# Altium project night-cone-proto0.PrjPcb (part 2 of 2)
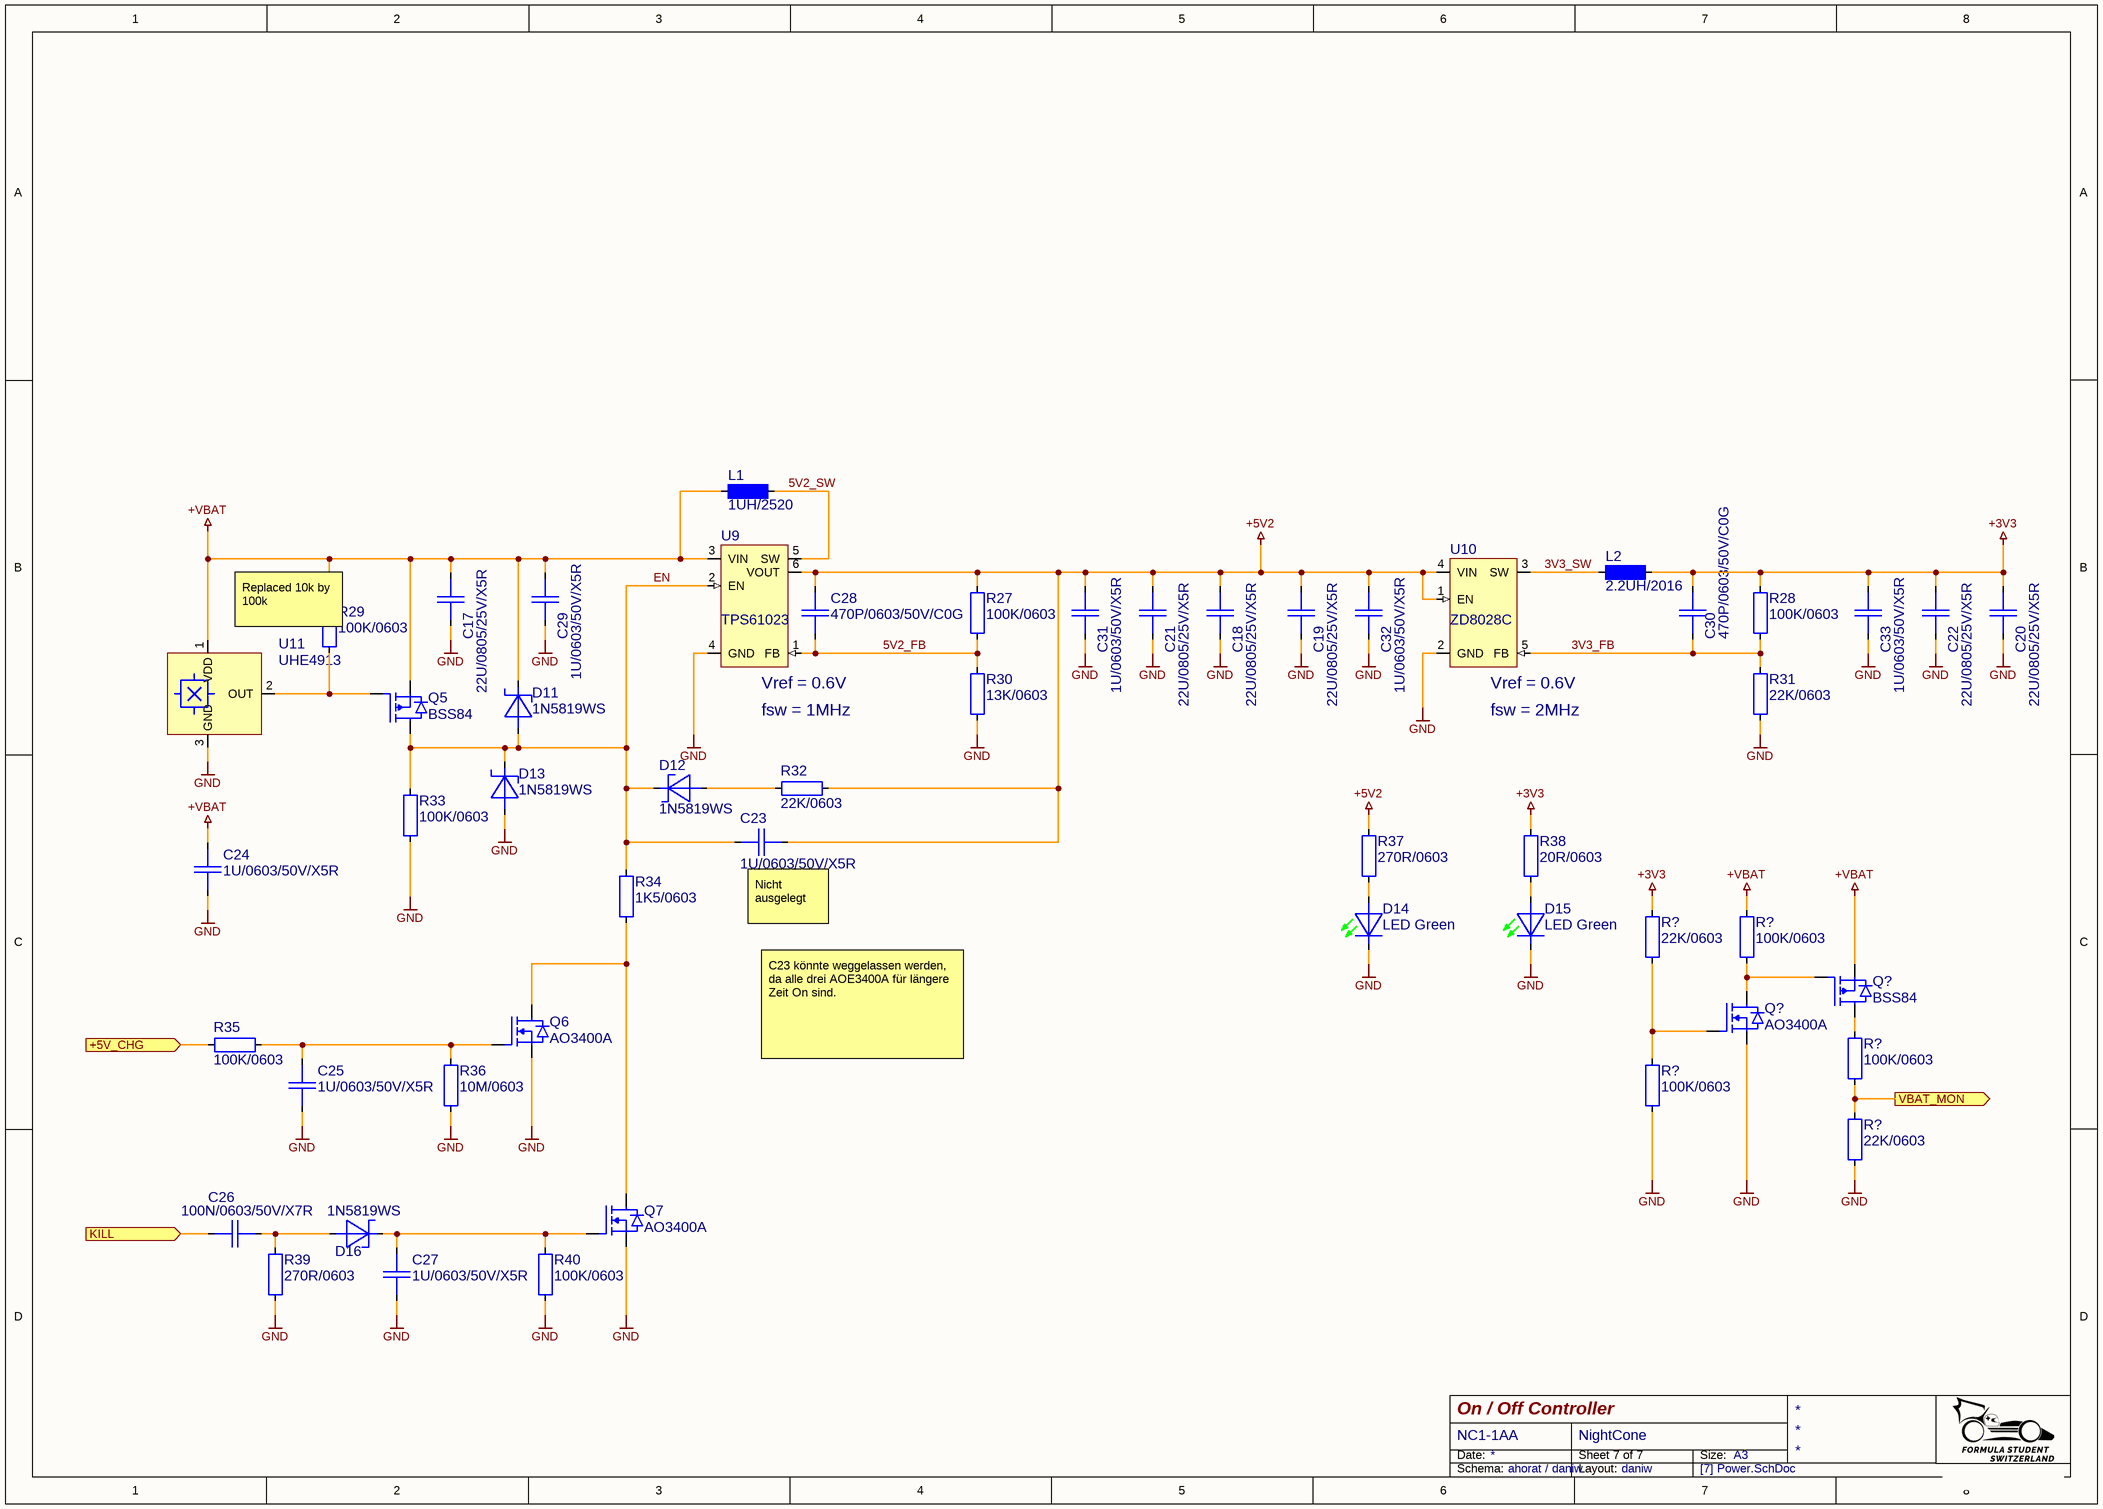
[diagram p7: [7] Power.SchDoc]

## Nets that join several sheets
+3V3: [2] Control (M1.8 M2.8 R1.1 R2.1), [7] Power (8 pins)
+5V2: [3] FailSafe (15 pins), Lights/LED0 (C11_LED0.1 R15_LED0.1 U6_LED0.2), Lights/LED1 (C11_LED1.1 R15_LED1.1 U6_LED1.2), Lights/LED2 (C11_LED2.1 R15_LED2.1 U6_LED2.2), Lights/LED3 (C11_LED3.1 R15_LED3.1 U6_LED3.2), Lights/LED4 (C11_LED4.1 R15_LED4.1 U6_LED4.2), Lights/LED5 (C11_LED5.1 R15_LED5.1 U6_LED5.2), Lights/LED6 (C11_LED6.1 R15_LED6.1 U6_LED6.2), Lights/LED7 (C11_LED7.1 R15_LED7.1 U6_LED7.2), Lights/LED8 (C11_LED8.1 R15_LED8.1 U6_LED8.2), Lights/LED9 (C11_LED9.1 R15_LED9.1 U6_LED9.2), Lights/LED10 (C11_LED10.1 R15_LED10.1 U6_LED10.2), Lights/LED11 (C11_LED11.1 R15_LED11.1 U6_LED11.2), Lights/LED12 (C11_LED12.1 R15_LED12.1 U6_LED12.2), Lights/LED13 (C11_LED13.1 R15_LED13.1 U6_LED13.2), Lights/LED14 (C11_LED14.1 R15_LED14.1 U6_LED14.2), Lights/LED15 (C11_LED15.1 R15_LED15.1 U6_LED15.2), Lights/LED16 (C11_LED16.1 R15_LED16.1 U6_LED16.2), Lights/LED17 (C11_LED17.1 R15_LED17.1 U6_LED17.2), Lights/LED18 (C11_LED18.1 R15_LED18.1 U6_LED18.2), Lights/LED19 (C11_LED19.1 R15_LED19.1 U6_LED19.2), [7] Power (13 pins)
+VBAT: [6] Charger (5 pins), [7] Power (11 pins)
GND: [2] Control (M1.1 M2.15), [3] FailSafe (18 pins), Lights/LED0 (C11_LED0.2 C12_LED0.2 U6_LED0.5 U6_LED0.6), Lights/LED1 (C11_LED1.2 C12_LED1.2 U6_LED1.5), Lights/LED2 (C11_LED2.2 C12_LED2.2 U6_LED2.5), Lights/LED3 (C11_LED3.2 C12_LED3.2 U6_LED3.5), Lights/LED4 (C11_LED4.2 C12_LED4.2 U6_LED4.5), Lights/LED5 (C11_LED5.2 C12_LED5.2 U6_LED5.5), Lights/LED6 (C11_LED6.2 C12_LED6.2 U6_LED6.5), Lights/LED7 (C11_LED7.2 C12_LED7.2 U6_LED7.5), Lights/LED8 (C11_LED8.2 C12_LED8.2 U6_LED8.5), Lights/LED9 (C11_LED9.2 C12_LED9.2 U6_LED9.5), Lights/LED10 (C11_LED10.2 C12_LED10.2 U6_LED10.5), Lights/LED11 (C11_LED11.2 C12_LED11.2 U6_LED11.5), Lights/LED12 (C11_LED12.2 C12_LED12.2 U6_LED12.5), Lights/LED13 (C11_LED13.2 C12_LED13.2 U6_LED13.5), Lights/LED14 (C11_LED14.2 C12_LED14.2 U6_LED14.5), Lights/LED15 (C11_LED15.2 C12_LED15.2 U6_LED15.5), Lights/LED16 (C11_LED16.2 C12_LED16.2 U6_LED16.5), Lights/LED17 (C11_LED17.2 C12_LED17.2 U6_LED17.5), Lights/LED18 (C11_LED18.2 C12_LED18.2 U6_LED18.5), Lights/LED19 (C11_LED19.2 C12_LED19.2 U6_LED19.5), [6] Charger (14 pins), [7] Power (30 pins)
+5V_CHG: [6] Charger (9 pins), [7] Power (R35.1)
B1: Lights/LED0 (R16_LED0.2 R17_LED0.2), Lights/LED1 (U6_LED1.6)
B2: Lights/LED1 (R16_LED1.2 R17_LED1.2), Lights/LED2 (U6_LED2.6)
B3: Lights/LED2 (R16_LED2.2 R17_LED2.2), Lights/LED3 (U6_LED3.6)
B4: Lights/LED3 (R16_LED3.2 R17_LED3.2), Lights/LED4 (U6_LED4.6)
B5: Lights/LED4 (R16_LED4.2 R17_LED4.2), Lights/LED5 (U6_LED5.6)
B6: Lights/LED5 (R16_LED5.2 R17_LED5.2), Lights/LED6 (U6_LED6.6)
B7: Lights/LED6 (R16_LED6.2 R17_LED6.2), Lights/LED7 (U6_LED7.6)
B8: Lights/LED7 (R16_LED7.2 R17_LED7.2), Lights/LED8 (U6_LED8.6)
B9: Lights/LED8 (R16_LED8.2 R17_LED8.2), Lights/LED9 (U6_LED9.6)
B10: Lights/LED9 (R16_LED9.2 R17_LED9.2), Lights/LED10 (U6_LED10.6)
B11: Lights/LED10 (R16_LED10.2 R17_LED10.2), Lights/LED11 (U6_LED11.6)
B12: Lights/LED11 (R16_LED11.2 R17_LED11.2), Lights/LED12 (U6_LED12.6)
B13: Lights/LED12 (R16_LED12.2 R17_LED12.2), Lights/LED13 (U6_LED13.6)
B14: Lights/LED13 (R16_LED13.2 R17_LED13.2), Lights/LED14 (U6_LED14.6)
B15: Lights/LED14 (R16_LED14.2 R17_LED14.2), Lights/LED15 (U6_LED15.6)
B16: Lights/LED15 (R16_LED15.2 R17_LED15.2), Lights/LED16 (U6_LED16.6)
B17: Lights/LED16 (R16_LED16.2 R17_LED16.2), Lights/LED17 (U6_LED17.6)
B18: Lights/LED17 (R16_LED17.2 R17_LED17.2), Lights/LED18 (U6_LED18.6)
B19: Lights/LED18 (R16_LED18.2 R17_LED18.2), Lights/LED19 (U6_LED19.6)
B20: [4] Lights (TP2.1), Lights/LED19 (R16_LED19.2 R17_LED19.2)
CHG_A: [1] night-cone-proto0-Top (J1.1), [6] Charger (D2.2 D8.1)
CHG_B: [1] night-cone-proto0-Top (J2.1), [6] Charger (D3.2 D9.1)
CHG_C: [1] night-cone-proto0-Top (J3.1), [6] Charger (D4.2 D10.1)
D1: Lights/LED0 (U6_LED0.3), Lights/LED1 (R17_LED1.1 U6_LED1.4)
D2: Lights/LED1 (U6_LED1.3), Lights/LED2 (R17_LED2.1 U6_LED2.4)
D3: Lights/LED2 (U6_LED2.3), Lights/LED3 (R17_LED3.1 U6_LED3.4)
D4: Lights/LED3 (U6_LED3.3), Lights/LED4 (R17_LED4.1 U6_LED4.4)
D5: Lights/LED4 (U6_LED4.3), Lights/LED5 (R17_LED5.1 U6_LED5.4)
D6: Lights/LED5 (U6_LED5.3), Lights/LED6 (R17_LED6.1 U6_LED6.4)
D7: Lights/LED6 (U6_LED6.3), Lights/LED7 (R17_LED7.1 U6_LED7.4)
D8: Lights/LED7 (U6_LED7.3), Lights/LED8 (R17_LED8.1 U6_LED8.4)
D9: Lights/LED8 (U6_LED8.3), Lights/LED9 (R17_LED9.1 U6_LED9.4)
D10: Lights/LED9 (U6_LED9.3), Lights/LED10 (R17_LED10.1 U6_LED10.4)
D11: Lights/LED10 (U6_LED10.3), Lights/LED11 (R17_LED11.1 U6_LED11.4)
D12: Lights/LED11 (U6_LED11.3), Lights/LED12 (R17_LED12.1 U6_LED12.4)
D13: Lights/LED12 (U6_LED12.3), Lights/LED13 (R17_LED13.1 U6_LED13.4)
D14: Lights/LED13 (U6_LED13.3), Lights/LED14 (R17_LED14.1 U6_LED14.4)
D15: Lights/LED14 (U6_LED14.3), Lights/LED15 (R17_LED15.1 U6_LED15.4)
D16: Lights/LED15 (U6_LED15.3), Lights/LED16 (R17_LED16.1 U6_LED16.4)
D17: Lights/LED16 (U6_LED16.3), Lights/LED17 (R17_LED17.1 U6_LED17.4)
D18: Lights/LED17 (U6_LED17.3), Lights/LED18 (R17_LED18.1 U6_LED18.4)
D19: Lights/LED18 (U6_LED18.3), Lights/LED19 (R17_LED19.1 U6_LED19.4)
D20: [4] Lights (TP1.1), Lights/LED19 (U6_LED19.3)
DATA: [2] Control (M1.3 M2.16), [3] FailSafe (Q1.1 R7.2)
DATA_FAILSAFE: [3] FailSafe (R100.2), Lights/LED0 (R17_LED0.1 U6_LED0.4)
KILL: [2] Control (M1.2 M2.7), [7] Power (C26.1)
VBAT_MON: [2] Control (M2.2), [7] Power (R?#3.2 R?#5.1)

## Assembly variants
WS2813B-B: not fitted C67 M1 Q2 R16 R19 R22 R25 R28 R31 R34 R37 R40 R43 R46 R49 R52 R55 R58 R61 R64 R67 R70 R73; alternate parts U6 -> WS2813B-B, U13 -> WS2813B-B, U14 -> WS2813B-B, U15 -> WS2813B-B, U16 -> WS2813B-B, U17 -> WS2813B-B, U18 -> WS2813B-B, U19 -> WS2813B-B, U20 -> WS2813B-B, U21 -> WS2813B-B, U22 -> WS2813B-B, U23 -> WS2813B-B, U24 -> WS2813B-B, U25 -> WS2813B-B, U7 -> WS2813B-B, U8 -> WS2813B-B, U9 -> WS2813B-B, U10 -> WS2813B-B, U11 -> WS2813B-B, U12 -> WS2813B-B
WS2813B-V5: not fitted C12 C14 C16 C18 C20 C22 C24 C26 C28 C30 C32 C34 C36 C38 C40 C42 C44 C46 C48 C50 C67 M1 Q2 R15 R17 R18 R20 R21 R23 R24 R26 R27 R29 R30 R32 R33 R35 R36 R38 R39 R41 R42 R44 R45 R47 R48 R50 R51 R53 R54 R56 R57 R59 R60 R62 R63 R65 R66 R68 R69 R71 R72 R74; alternate parts R8 -> 910R/0603, R10 -> 1K2/0603
WS2813C: not fitted C67 M1 Q2 R16 R19 R22 R25 R28 R31 R34 R37 R40 R43 R46 R49 R52 R55 R58 R61 R64 R67 R70 R73; alternate parts U6 -> WS2813C, U13 -> WS2813C, U14 -> WS2813C, U15 -> WS2813C, U16 -> WS2813C, U17 -> WS2813C, U18 -> WS2813C, U19 -> WS2813C, U20 -> WS2813C, U21 -> WS2813C, U22 -> WS2813C, U23 -> WS2813C, U24 -> WS2813C, U25 -> WS2813C, U7 -> WS2813C, U8 -> WS2813C, U9 -> WS2813C, U10 -> WS2813C, U11 -> WS2813C, U12 -> WS2813C
WS2813E: not fitted C12 C14 C16 C18 C20 C22 C24 C26 C28 C30 C32 C34 C36 C38 C40 C42 C44 C46 C48 C50 C67 M1 Q2 R15 R16 R18 R19 R21 R22 R24 R25 R27 R28 R30 R31 R33 R34 R36 R37 R39 R40 R42 R43 R45 R46 R48 R49 R51 R52 R54 R55 R57 R58 R60 R61 R63 R64 R66 R67 R69 R70 R72 R73; alternate parts U6 -> WS2813E, U13 -> WS2813E, U14 -> WS2813E, U15 -> WS2813E, U16 -> WS2813E, U17 -> WS2813E, U18 -> WS2813E, U19 -> WS2813E, U20 -> WS2813E, U21 -> WS2813E, U22 -> WS2813E, U23 -> WS2813E, U24 -> WS2813E, U25 -> WS2813E, U7 -> WS2813E, U8 -> WS2813E, U9 -> WS2813E, U10 -> WS2813E, U11 -> WS2813E, U12 -> WS2813E